# Altium schematic sheet V1.0.SchDoc
size 152 x 101 mm
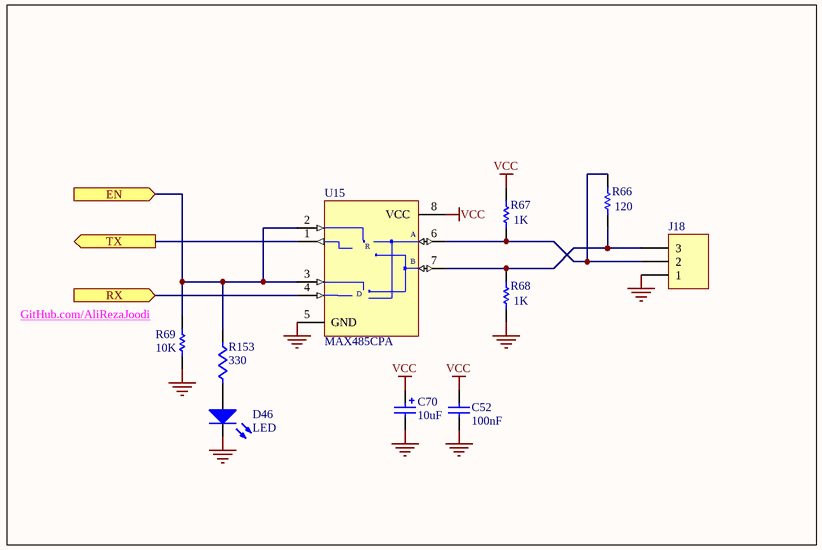
[diagram p0: V1.0.SchDoc]

## Parts
C52  value 100nF  [0805]  (hidden comment: Cap)
C70  value 10uF  [Cap_B]  (hidden comment: Capacitor)
D46  LED  [0805_Diode]
J18  Header 3  [Fonics_3PIN_1]  (value not drawn)
R66  value 120  [RESC3216N]  (hidden comment: Res1)
R67  value 1K  [0805]  (hidden comment: Res1)
R68  value 1K  [0805]  (hidden comment: Res1)
R69  value 10K  [0805]  (hidden comment: Res1)
R153  value 330  [0805]  (hidden comment: Res1)
U15  MAX485CPA  [SOP127P636-8N]

## Ports
EN (in), RX (in), TX (out)

## Nets
GND: C52.1 C70.2 D46.2(K) J18.1 R68.2 R69.1 U15.5(GND)
VCC: C52.2 C70.1 R67.1 U15.8(VCC)
EN: R69.2 R153.1 U15.2(~{RE}) U15.3(DE) ; port EN
RX: U15.4(DI) ; port RX
TX: U15.1(RO) ; port TX
NetD46_1: D46.1(A) R153.2
NetJ18_2: J18.2 R66.1 R67.2 U15.6(A)
NetJ18_3: J18.3 R66.2 R68.1 U15.7(B)

## Notes on the sheet
- (near R69) GitHub.com/AliRezaJoodi
- (in symbol MAX485CPA) R; D

## Library data of the parts
C52 = Cap: Capacitor; Manufacturer: Generic Components; Class I: Passive; Published: 8-Jun-2000; Revision: July-2002: Re-released for DXP Platform.; Publisher: Altium Limited; Class II: Capacitor
C70 = Cap Pol1: Polarized Capacitor (Radial); Manufacturer: Generic Components; Class I: Passive; Published: 8-Jun-2000; Revision: July-2002: Re-released for DXP Platform.; Publisher: Altium Limited; Class II: Capacitor
D46 = LED: Typical INFRARED GaAs LED; Manufacturer: Generic Components; Class I: Optoelectronic; Published: 8-Jun-2000; Revision: July-2002: Re-released for DXP Platform.; Publisher: Altium Limited; Class II: LED
J18 = Header 3: Header, 3-Pin; Manufacturer: Generic Components; Class I: Connector; Revision: July-2002: Re-released for DXP Platform.; Publisher: Altium Limited
R66-R69 = Res1: Resistor; Published: 8-Jun-2000; LatestRevisionDate: 17-Jul-2002; LatestRevisionNote: Re-released for DXP Platform.; PackageReference: AXIAL-0.3; Publisher: Altium Limited
R153 = Res1: Resistor; Manufacturer: Generic Components; Class I: Passive; Published: 8-Jun-2000; Revision: July-2002: Re-released for DXP Platform.; Publisher: Altium Limited; Class II: Resistor
U15 = MAX485CPA: Low-Power, Slew-Rate-Limited RS-485/RS-422 Transceiver; Published: 16-Jan-2001; LatestRevisionDate: 29-May-2009; LatestRevisionNote: Component Body Added.; DatasheetVersion: Feb-1996; PackageVersion: RevB, 21-0043; PackageReference: PA8; Publisher: Altium Limited; PackageDescription: DIP, 8-Pin, Row Spacing 7.62 mm, Pitch 2.54 mm; Code_JEDEC: MS-001-AB; ComponentLink1Description: Manufacturer Link; ComponentLink1URL: http://www.maxim-ic.com/; ComponentLink2Description: Datasheet; ComponentLink2URL: http://pdfserv.maxim-ic.com/en/ds/MAX1487-MAX491.pdf